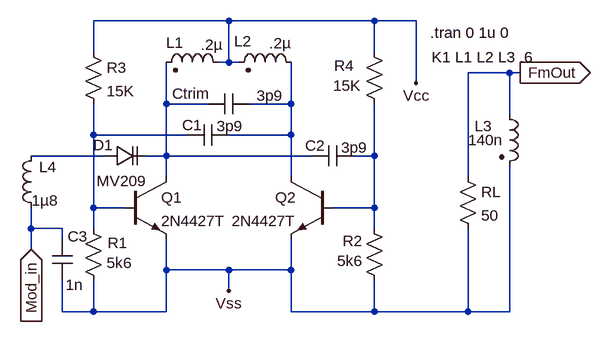
[diagram p0: schematic 3W_Out.asc]
3W_Out.asc, the LTspice schematic file:
Version 4
SHEET 1 880 680
WIRE -96 384 -96 352
WIRE -96 416 -96 384
WIRE -48 384 -96 384
WIRE -48 400 -48 384
WIRE -48 512 -48 464
WIRE 0 112 0 64
WIRE 0 240 0 192
WIRE 0 352 0 240
WIRE 0 384 0 352
WIRE 0 512 -48 512
WIRE 0 512 0 464
WIRE 16 272 -96 272
WIRE 48 352 0 352
WIRE 112 192 112 128
WIRE 112 272 80 272
WIRE 112 272 112 192
WIRE 112 304 112 272
WIRE 112 448 112 400
WIRE 112 512 0 512
WIRE 112 512 112 448
WIRE 144 240 0 240
WIRE 176 192 112 192
WIRE 208 64 0 64
WIRE 208 128 192 128
WIRE 208 128 208 64
WIRE 208 448 112 448
WIRE 208 480 208 448
WIRE 224 128 208 128
WIRE 304 192 240 192
WIRE 304 192 304 128
WIRE 304 240 208 240
WIRE 304 240 304 192
WIRE 304 304 304 240
WIRE 304 448 208 448
WIRE 304 448 304 400
WIRE 304 512 304 448
WIRE 336 272 112 272
WIRE 432 64 208 64
WIRE 432 112 432 64
WIRE 432 272 400 272
WIRE 432 272 432 192
WIRE 432 352 368 352
WIRE 432 352 432 272
WIRE 432 384 432 352
WIRE 432 512 304 512
WIRE 432 512 432 464
WIRE 496 64 432 64
WIRE 496 160 496 64
WIRE 576 304 576 144
WIRE 576 512 432 512
WIRE 576 512 576 384
WIRE 640 144 576 144
WIRE 640 208 640 144
WIRE 640 512 576 512
WIRE 640 512 640 288
WIRE 656 144 640 144
FLAG 656 144 FmOut
IOPIN 656 144 Out
FLAG -96 416 Mod_in
IOPIN -96 416 In
FLAG 208 480 Vss
FLAG 496 160 Vcc
SYMBOL npn2 48 304 R0
SYMATTR InstName Q1
SYMATTR Value 2N4427T
SYMBOL npn2 368 304 M0
SYMATTR InstName Q2
SYMATTR Value 2N4427T
SYMBOL cap 240 176 R90
WINDOW 0 16 90 VBottom 0
WINDOW 3 -12 -31 VTop 0
SYMATTR InstName Ctrim
SYMATTR Value 3p9
SYMBOL ind2 208 144 M270
WINDOW 0 31 83 VTop 0
WINDOW 3 59 26 VBottom 0
SYMATTR InstName L1
SYMATTR Value .2µ
SYMBOL ind2 320 144 M270
WINDOW 0 33 90 VTop 0
WINDOW 3 61 33 VBottom 0
SYMATTR InstName L2
SYMATTR Value .2µ
SYMBOL res -16 368 R0
WINDOW 0 38 38 Left 0
WINDOW 3 36 69 Left 0
SYMATTR InstName R1
SYMATTR Value 5k6
SYMBOL res 416 368 R0
WINDOW 0 -33 35 Left 0
WINDOW 3 -41 66 Left 0
SYMATTR InstName R2
SYMATTR Value 5k6
SYMBOL res -16 96 R0
SYMATTR InstName R3
SYMATTR Value 15K
SYMBOL res 416 96 R0
WINDOW 0 -46 37 Left 0
WINDOW 3 -47 68 Left 0
SYMATTR InstName R4
SYMATTR Value 15K
SYMBOL ind2 624 192 R0
WINDOW 0 -38 34 Left 0
WINDOW 3 -48 56 Left 0
SYMATTR InstName L3
SYMATTR Value 140n
SYMATTR Type ind
SYMBOL res 560 288 R0
SYMATTR InstName RL
SYMATTR Value 50
SYMBOL cap 208 224 R90
WINDOW 0 16 56 VBottom 0
WINDOW 3 -13 -2 VTop 0
SYMATTR InstName C1
SYMATTR Value 3p9
SYMBOL cap 400 256 R90
WINDOW 0 16 59 VBottom 0
WINDOW 3 -12 -1 VTop 0
SYMATTR InstName C2
SYMATTR Value 3p9
SYMBOL varactor 16 288 R270
WINDOW 0 17 -1 VTop 0
WINDOW 3 -7 27 VBottom 0
SYMATTR InstName D1
SYMATTR Value MV209
SYMBOL ind -80 256 M0
WINDOW 0 -23 33 Left 0
WINDOW 3 -25 85 Left 0
SYMATTR InstName L4
SYMATTR Value 1µ8
SYMATTR SpiceLine Ipk=0.39 Rser=0.47 Rpar=170 Cpar=0 mfg="Coilcraft" pn="0603PS-182K"
SYMBOL cap -64 400 R0
WINDOW 0 24 -4 Left 0
WINDOW 3 21 71 Left 0
SYMATTR InstName C3
SYMATTR Value 1n
TEXT 518 82 Left 0 !.tran 0 1u 0
TEXT 520 120 Left 0 !K1 L1 L2 L3 .6

The netlist it stands for:
* 3W_Out.asc
Q1 N003 N001 Vss 0 2N4427T
Q2 N004 N005 Vss 0 2N4427T
Ctrim N004 N003 3p9
L1 Vcc N003 .2µ
L2 N004 Vcc .2µ
R1 N001 Vss 5k6
R2 N005 Vss 5k6
R3 Vcc N001 15K
R4 Vcc N005 15K
L3 FmOut Vss 140n
RL FmOut Vss 50
C1 N004 N001 3p9
C2 N005 N003 3p9
D1 N002 N003 MV209
L4 N002 Mod_in 1µ8 Ipk=0.39 Rser=0.47 Rpar=170 Cpar=0 mfg="Coilcraft" pn="0603PS-182K"
C3 Mod_in Vss 1n
.model D D
.lib standard.dio
.model NPN NPN
.model PNP PNP
.lib standard.bjt
.tran 0 1u 0
K1 L1 L2 L3 .6
.backanno
.end